# EAGLE design untitled (EAGLE 9.5.2)
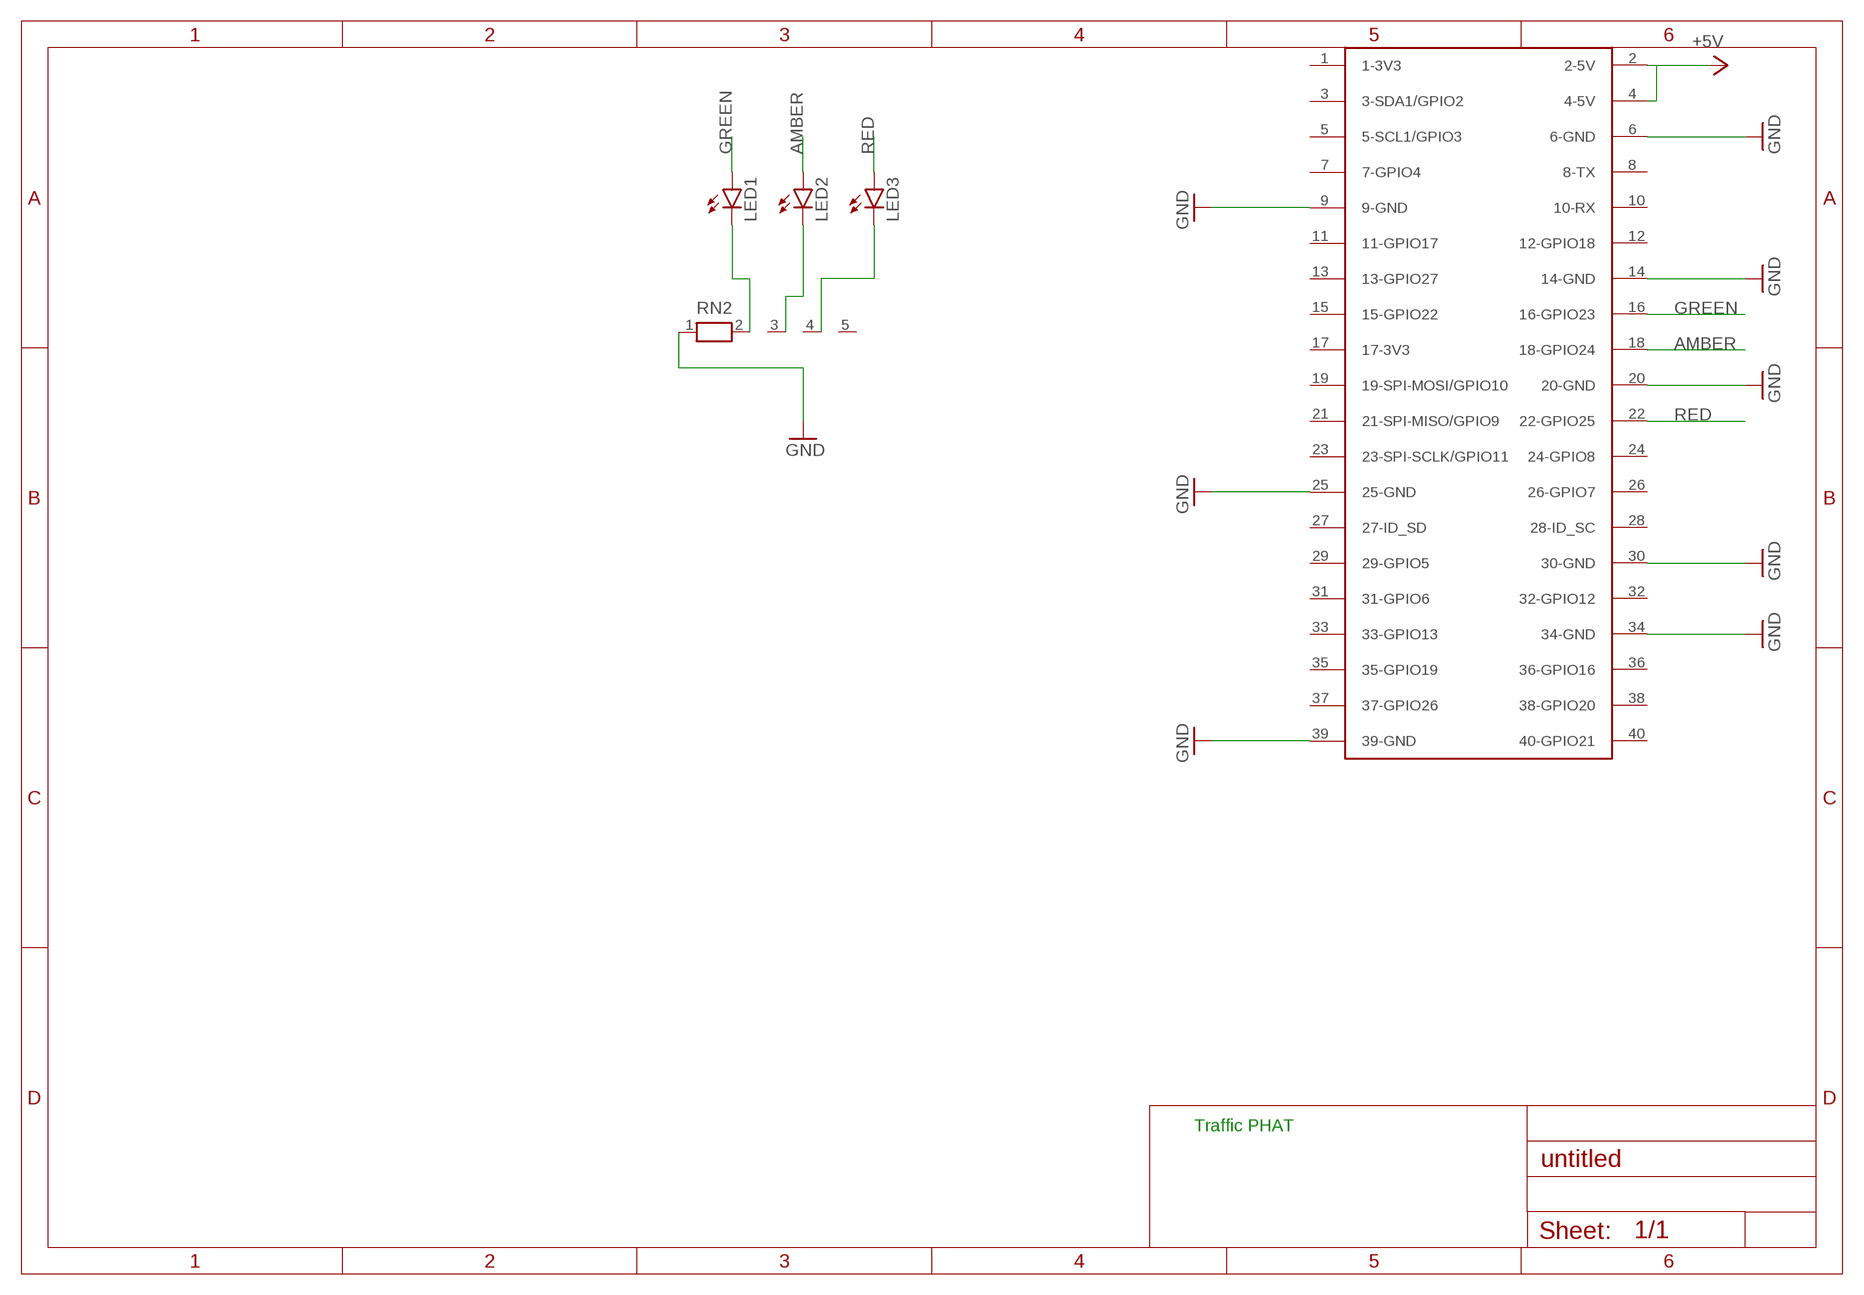
[diagram p0: schematic, sheet 1]

## Parts
LED1  LED10MM  [LED10MM]
LED2  LED10MM  [LED10MM]
LED3  LED10MM  [LED10MM]
RN2  RN04  [RN-5]
U$1  RASPBERRY-PI+HEADERONLY  [RASPBERRY-PI-PLUS-HEADERONLY]

## Nets
+5V: U$1.2(2-5V) U$1.4(4-5V)
AMBER: LED2.A U$1.18(18-GPIO24)
GND: RN2.1 U$1.6(6-GND) U$1.9(9-GND) U$1.14(14-GND) U$1.20(20-GND) U$1.25(25-GND) U$1.30(30-GND) U$1.34(34-GND) U$1.39(39-GND)
GREEN: LED1.A U$1.16(16-GPIO23)
N$1: LED1.K(C) RN2.2
N$2: LED2.K(C) RN2.3
N$3: LED3.K(C) RN2.4
RED: LED3.A U$1.22(22-GPIO25)
Unconnected: RN2.5 U$1.1(1-3V3) U$1.3(3-SDA1/GPIO2) U$1.5(5-SCL1/GPIO3) U$1.7(7-GPIO4) U$1.8(8-TX) U$1.10(10-RX) U$1.11(11-GPIO17) U$1.12(12-GPIO18) U$1.13(13-GPIO27) U$1.15(15-GPIO22) U$1.17(17-3V3) U$1.19(19-SPI-MOSI/GPIO10) U$1.21(21-SPI-MISO/GPIO9) U$1.23(23-SPI-SCLK/GPIO11) U$1.24(24-GPIO8) U$1.26(26-GPIO7) U$1.27(27-ID_SD) U$1.28(28-ID_SC) U$1.29(29-GPIO5) U$1.31(31-GPIO6) U$1.32(32-GPIO12) U$1.33(33-GPIO13) U$1.35(35-GPIO19) U$1.36(36-GPIO16) U$1.37(37-GPIO26) U$1.38(38-GPIO20) U$1.40(40-GPIO21)

## Notes on the sheet
- Traffic PHAT

## Library data of the parts
LED1-LED3 = led:LED: LED OSRAM: - CHIPLED LG R971, LG N971, LY N971, LG Q971, LY Q971, LO R971, LY R971 LH N974, LH R974 LS Q976, LO Q976, LY Q976 LO Q996 - Hyper CHIPLED LW Q18S LB Q993, LB Q99A, LB R99A - SideLED LS A670, LO A670, LY A670, LG A670, LP A670 LB A673, LV A673, LT A673, LW A673 LH A674 LY A675 LS A676, LA A676, LO A676, LY A676, LW A676 LS A679, LY A679, LG A679 - Hyper Micro SIDELED® LS Y876, LA Y876, LO Y876, LY Y876 LT Y87S - SmartLED LW L88C, LW L88S LB L89C, LB L89S, LG L890 LS L89K, LO L89K, LY L89K LS L896, LA L896, LO L896, LY L896 - TOPLED LS T670, LO T670, LY T670, LG T670, LP T670 LSG T670, LSP T670, LSY T670, LOP T670, LYG T670 LG T671, LOG T671, LSG T671 LB T673, LV T673, LT T673, LW T673 LH T674 LS T676, LA T676, LO T676, LY T676, LB T676, LH T676, LSB T676, LW T676 LB T67C, LV T67C, LT T67C, LS T67K, LO T67K, LY T67K, LW E67C LS E67B, LA E67B, LO E67B, LY E67B, LB E67C, LV E67C, LT E67C LW T67C LS T679, LY T679, LG T679 LS T770, LO T770, LY T770, LG T770, LP T770 LB T773, LV T773, LT T773, LW T773 LH T774 LS E675, LA E675, LY E675, LS T675 LS T776, LA T776, LO T776, LY T776, LB T776 LHGB T686 LT T68C, LB T68C - Hyper Mini TOPLED® LB M676 - Mini TOPLED Santana® LG M470 LS M47K, LO M47K, LY M47K Source: http://www.osram.convergy.de LUXEON: - LUMILED® LXK2-PW12-R00, LXK2-PW12-S00, LXK2-PW14-U00, LXK2-PW14-V00 LXK2-PM12-R00, LXK2-PM12-S00, LXK2-PM14-U00 LXK2-PE12-Q00, LXK2-PE12-R00, LXK2-PE12-S00, LXK2-PE14-T00, LXK2-PE14-U00 LXK2-PB12-K00, LXK2-PB12-L00, LXK2-PB12-M00, LXK2-PB14-N00, LXK2-PB14-P00, LXK2-PB14-Q00 LXK2-PR12-L00, LXK2-PR12-M00, LXK2-PR14-Q00, LXK2-PR14-R00 LXK2-PD12-Q00, LXK2-PD12-R00, LXK2-PD12-S00 LXK2-PH12-R00, LXK2-PH12-S00 LXK2-PL12-P00, LXK2-PL12-Q00, LXK2-PL12-R00 Source: www.luxeon.com KINGBRIGHT: KA-3528ASYC Source: www.kingbright.com
RN2 = resistor-net:RN04: RESISTOR NETWORK; OC_FARNELL: unknown; OC_NEWARK: unknown
U$1 = Ava2:RASPBERRY-PI+: Samtec SSW-120-01-T-D

## Board
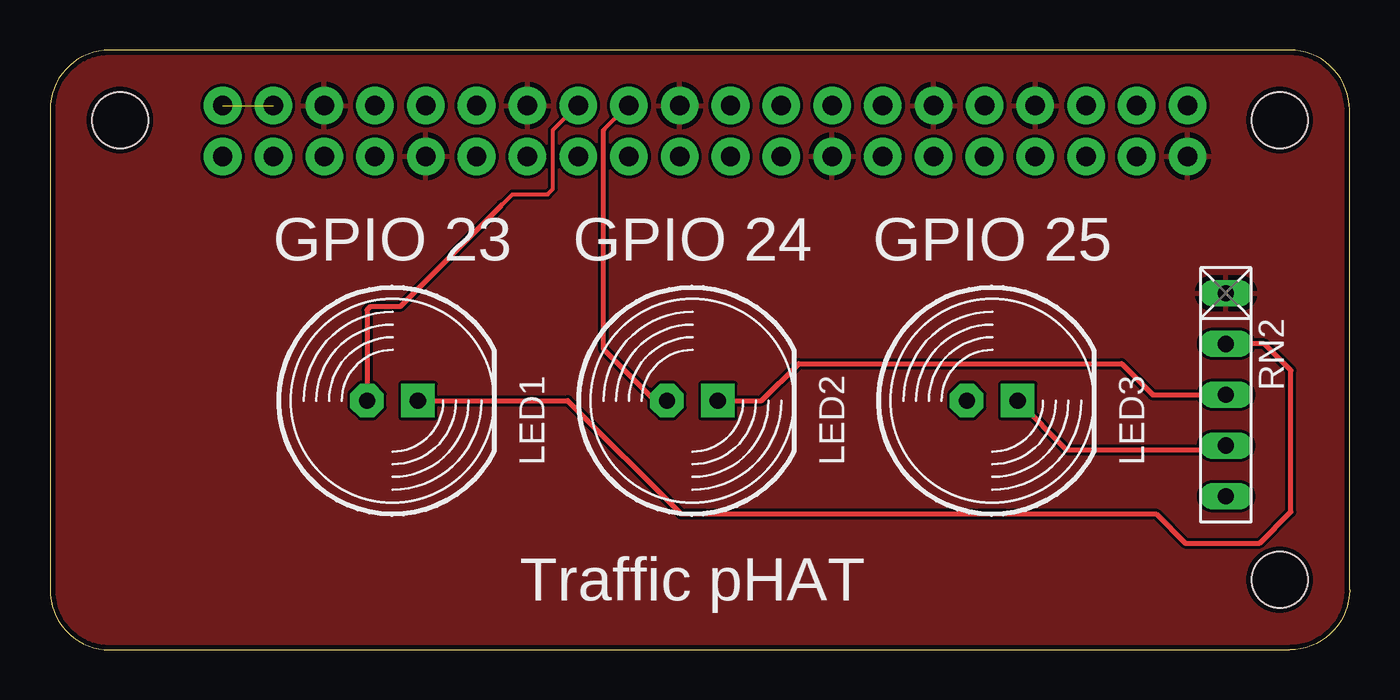
[diagram p1: board, top side]
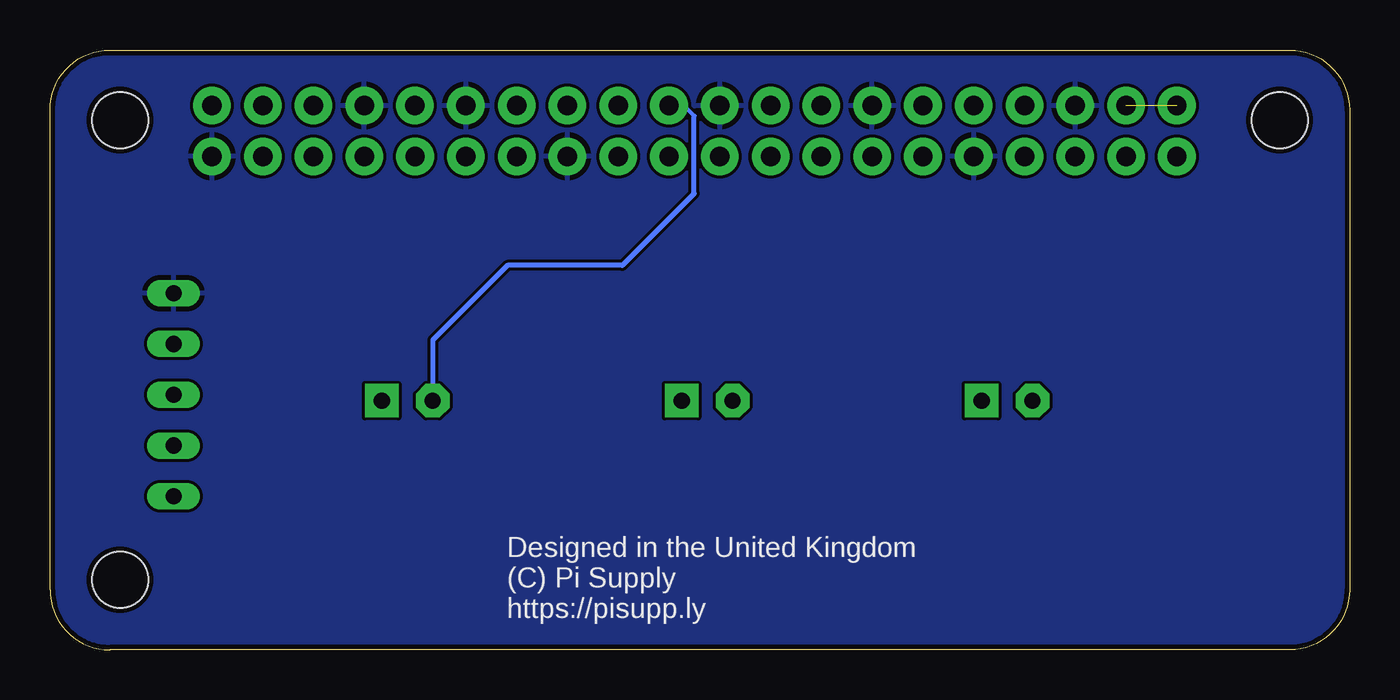
[diagram p2: board, bottom side, seen from below]

Size 65 x 30 mm. Coordinates in mm from the lower left corner, seen from the top.
Outline: 3,0 62,0 arc90 65,3 65,26.99 arc90 62,29.99 3,29.99 arc90 0,26.99 0,3 arc90 3,0
Copper layers (1*16): Top 0.035mm / dielectric 1.5mm / Bottom 0.035mm
Design rules "dirt_cheap_dirty_boards.v1.1": minimum track width 6mil, minimum drill 12mil, track to track 6mil, track to pad 6mil, pad to pad 6mil, via to via 6mil, smd to smd 0mil, copper to edge 10mil, drill to drill 10mil, minimum pad ring 10mil, minimum via ring 6mil, stop-mask expansion 2mil, vias tented up to drill 25mil, thermal gap 10mil
Holes 2.8 mm at 3.5,26.5 61.5,26.5 61.5,3.5

### Footprints (pad centres in the part's own frame; a part is rotated, then mirrored left to right if it is on the bottom)
LED10MM = drill 0.813 pad 1.676 octagon: A -1.27,0 | drill 0.813 pad 1.676 square: K 1.27,0
RN-5 = drill 0.813 long: 1 -5.08,0; 2 -2.54,0; 3 0,0; 4 2.54,0; 5 5.08,0
RASPBERRY-PI-PLUS-HEADERONLY = drill 0.97 pad 1.88: 1 -23.97,-1.218; 2 -23.97,1.323; 3 -21.43,-1.218; 4 -21.43,1.323; 5 -18.89,-1.218; 6 -18.89,1.323; 7 -16.35,-1.218; 8 -16.35,1.323; 9 -13.81,-1.218; 10 -13.81,1.323; 11 -11.27,-1.218; 12 -11.27,1.323; 13 -8.73,-1.218; 14 -8.73,1.323; 15 -6.19,-1.218; 16 -6.19,1.323; 17 -3.65,-1.218; 18 -3.65,1.323; 19 -1.11,-1.218; 20 -1.11,1.323; 21 1.43,-1.218; 22 1.43,1.323; 23 3.97,-1.218; 24 3.97,1.323; 25 6.51,-1.218; 26 6.51,1.323; 27 9.05,-1.218; 28 9.05,1.323; 29 11.59,-1.218; 30 11.59,1.323; 31 14.13,-1.218; 32 14.14,1.323; 33 16.67,-1.218; 34 16.67,1.323; 35 19.21,-1.218; 36 19.21,1.323; 37 21.75,-1.218; 38 21.75,1.323; 39 24.29,-1.218; 40 24.29,1.323

### Placement (x,y rotation side)
LED1  17.13,12.46 0 top
LED2  32.13,12.46 0 top
LED3  47.13,12.46 0 top
RN2  58.82,12.76 270 top
U$1  32.61,25.89 0 top

### Tracks (layer width: path | path; a pad name or v marks a point on that pad's centre or on a via)
+5V  (1 unrouted)
AMBER
  Top 0.203: 27.7,26 28.92,27.22 U$1.18
  Top 0.254: LED2.A 30.27,12.46 27.7,15.03 27.7,26
GND
  pour Top: -9.89,-5.76 -9.89,26.63 0.9,37.42 63.77,37.42 71.39,29.8 71.39,5.67 63.13,-2.58 59.96,-5.76
  pour Bottom: -9.26,-8.3 -9.26,24.09 1.54,34.88 64.4,34.88 72.02,27.26 72.02,3.13 63.77,-5.12 60.59,-8.3
GREEN
  Top 0.203: 22.59,22.24 23.13,22.78 24.89,22.78 25.16,23.05 25.16,26 26.38,27.22 U$1.16
  Top 0.254: LED1.A 15.86,17 16.02,17.16 17.51,17.16 22.59,22.24
N$1
  Top 0.254: LED1.K 25.9,12.46 31.56,6.8 55.33,6.8 56.78,5.34 60.51,5.34 62.07,6.9 62.07,13.98 60.74,15.3 RN2.2
N$2
  Top 0.254: LED2.K 35.59,12.46 37.45,14.31 53.6,14.31 55.16,12.76 RN2.3
N$3
  Top 0.254: LED3.K 50.84,10.01 58.61,10.01 RN2.4
RED
  Bottom 0.203: 32.78,26.71 33.29,27.22 U$1.22
  Bottom 0.254: 32.78,26.71 32.78,22.81 36.37,19.22 42.12,19.22 45.86,15.49 LED3.A

### Text on the board
tNames: GPIO 23 | GPIO 24 | GPIO 25 | Traffic pHAT
bNames: Designed in the United Kingdom / (C) Pi Supply / https://pisupp.ly